# EAGLE design esp-wroom-02-eval-board (EAGLE 7.3.0)
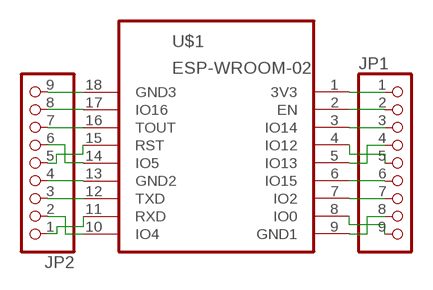
[diagram p0: schematic, sheet 1]

## Parts
JP1  PINHD-1X9  [1X09]
JP2  PINHD-1X9  [1X09]
U$1  ESP-WROOM-02  [ESP-WROOM-02]

## Nets
N$1: JP2.9 U$1.18(GND3)
N$2: JP2.8 U$1.17(IO16)
N$3: JP2.7 U$1.16(TOUT)
N$4: JP2.5 U$1.15(RST)
N$5: JP2.6 U$1.14(IO5)
N$6: JP2.4 U$1.13(GND2)
N$7: JP2.3 U$1.12(TXD)
N$8: JP2.2 U$1.10(IO4)
N$9: JP2.1 U$1.11(RXD)
N$10: JP1.8 U$1.9(GND1)
N$11: JP1.9 U$1.8(IO0)
N$12: JP1.7 U$1.7(IO2)
N$13: JP1.6 U$1.6(IO15)
N$14: JP1.4 U$1.5(IO13)
N$15: JP1.5 U$1.4(IO12)
N$16: JP1.3 U$1.3(IO14)
N$17: JP1.2 U$1.2(EN)
N$18: JP1.1 U$1.1(3V3)

## Library data of the parts
JP1 JP2 = pinhead:PINHD-1X9: PIN HEADER
U$1 = esp-wroom-02:ESP-WROOM-02

## Board
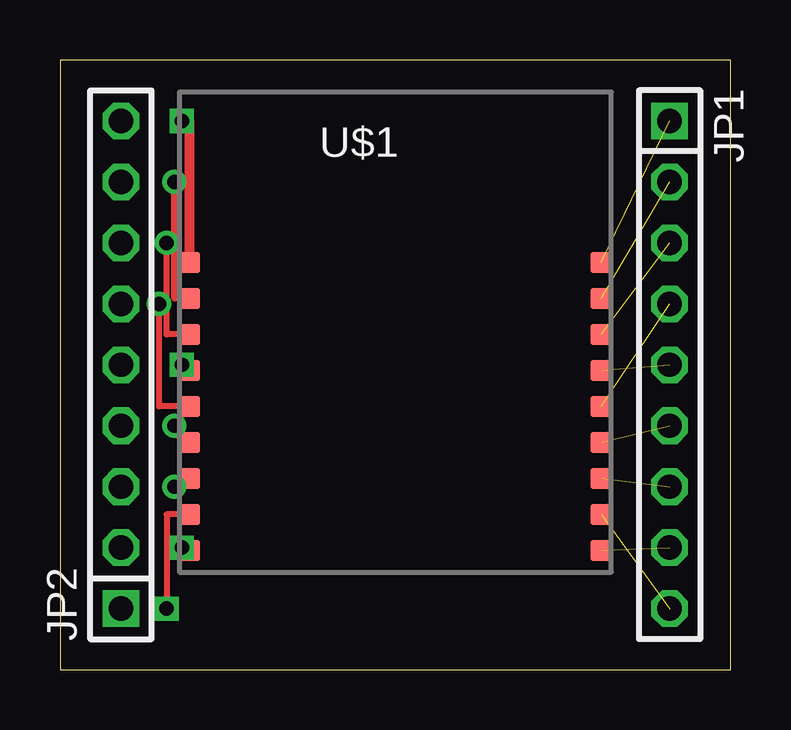
[diagram p1: board, top side]
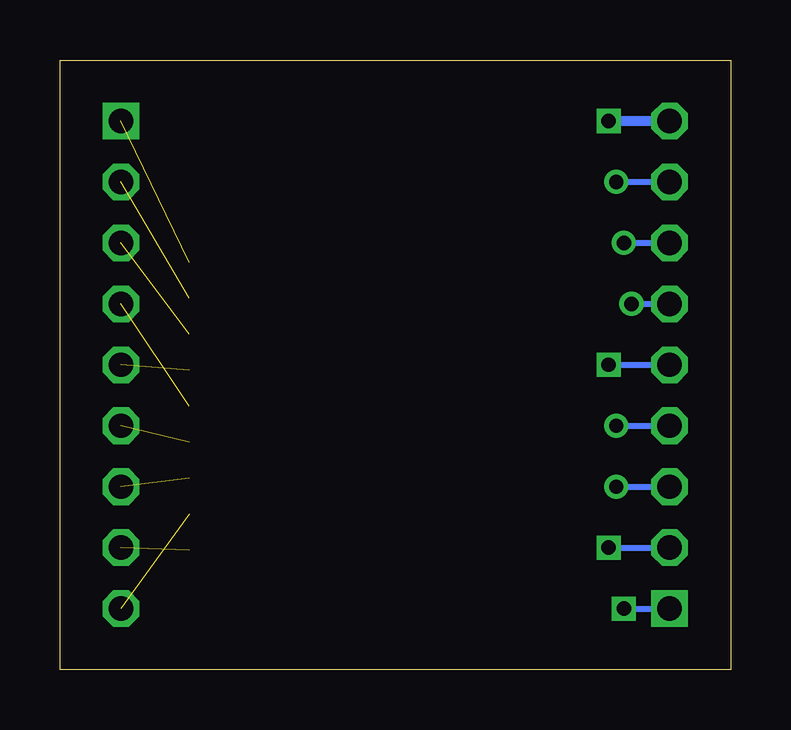
[diagram p2: board, bottom side, seen from below]

Size 27.94 x 25.4 mm. Coordinates in mm from the lower left corner, seen from the top.
Outline: 0,0 27.94,0 27.94,25.4 0,25.4 0,0
Copper layers (1*16): Top 0.035mm / dielectric 1.5mm / Bottom 0.035mm
Design rules "default": minimum track width 10mil, minimum drill 24mil, track to track 8mil, track to pad 8mil, pad to pad 8mil, via to via 8mil, smd to smd 8mil, copper to edge 40mil, drill to drill 8mil, minimum pad ring 10mil, minimum via ring 8mil, stop-mask expansion 4mil, vias tented up to drill 0mil, thermal gap 10mil

### Footprints (pad centres in the part's own frame; a part is rotated, then mirrored left to right if it is on the bottom)
1X09 = drill 1.016 square: 1 -10.16,0 | drill 1.016 octagon: 2 -7.62,0; 3 -5.08,0; 4 -2.54,0; 5 0,0; 6 2.54,0; 7 5.08,0; 8 7.62,0; 9 10.16,0
ESP-WROOM-02 = smd 0.9 x 0.85: 1 8.575,4.9; 2 8.575,3.4; 3 8.575,1.9; 4 8.575,0.4; 5 8.575,-1.1; 6 8.575,-2.6; 7 8.575,-4.1; 8 8.575,-5.6; 9 8.575,-7.1; 10 -8.575,-7.1; 11 -8.575,-5.6; 12 -8.575,-4.1; 13 -8.575,-2.6; 14 -8.575,-1.1; 15 -8.575,0.4; 16 -8.575,1.9; 17 -8.575,3.4; 18 -8.575,4.9

### Placement (x,y rotation side)
JP1  25.4,12.7 270 top
JP2  2.54,12.7 90 top
U$1  13.97,12.06 0 top

### Tracks (layer width: path | path; a pad name or v marks a point on that pad's centre or on a via)
N$1  (via drill 0.6)
  Top 0.406: U$1.18 5.4,22.86 v5.08,22.86
  Bottom 0.406: v5.08,22.86 JP2.9
N$2  (via drill 0.6)
  Top 0.254: U$1.17 4.76,15.46 v4.76,20.32
  Bottom 0.254: v4.76,20.32 JP2.8
N$3  (via drill 0.6)
  Top 0.254: U$1.16 4.45,13.96 v4.45,17.78
  Bottom 0.254: v4.45,17.78 JP2.7
N$4  (via drill 0.6)
  Top 0.254: U$1.15 5.08,12.46 v5.08,12.7
  Bottom 0.254: v5.08,12.7 JP2.5
N$5  (via drill 0.6)
  Top 0.254: U$1.14 4.13,10.96 v4.13,15.24
  Bottom 0.254: v4.13,15.24 JP2.6
N$6  (via drill 0.6)
  Top 0.254: U$1.13 5.08,9.46 v4.76,10.16
  Bottom 0.254: v4.76,10.16 JP2.4
N$7  (via drill 0.6)
  Top 0.254: U$1.12 4.76,7.96 v4.76,7.62
  Bottom 0.254: v4.76,7.62 JP2.3
N$8  (via drill 0.6)
  Top 0.254: U$1.10 5.08,4.96 v5.08,5.08
  Bottom 0.254: v5.08,5.08 JP2.2
N$9  (via drill 0.6)
  Top 0.254: U$1.11 4.45,6.46 v4.45,2.54
  Bottom 0.254: v4.45,2.54 JP2.1
N$10  (1 unrouted)
N$11  (1 unrouted)
N$12  (1 unrouted)
N$13  (1 unrouted)
N$14  (1 unrouted)
N$15  (1 unrouted)
N$16  (1 unrouted)
N$17  (1 unrouted)
N$18  (1 unrouted)

### Text on the board
bDocu: GND3 | IO16 | TOUT | IO5 | RST | GND2 | TXD | IO4 | RXD